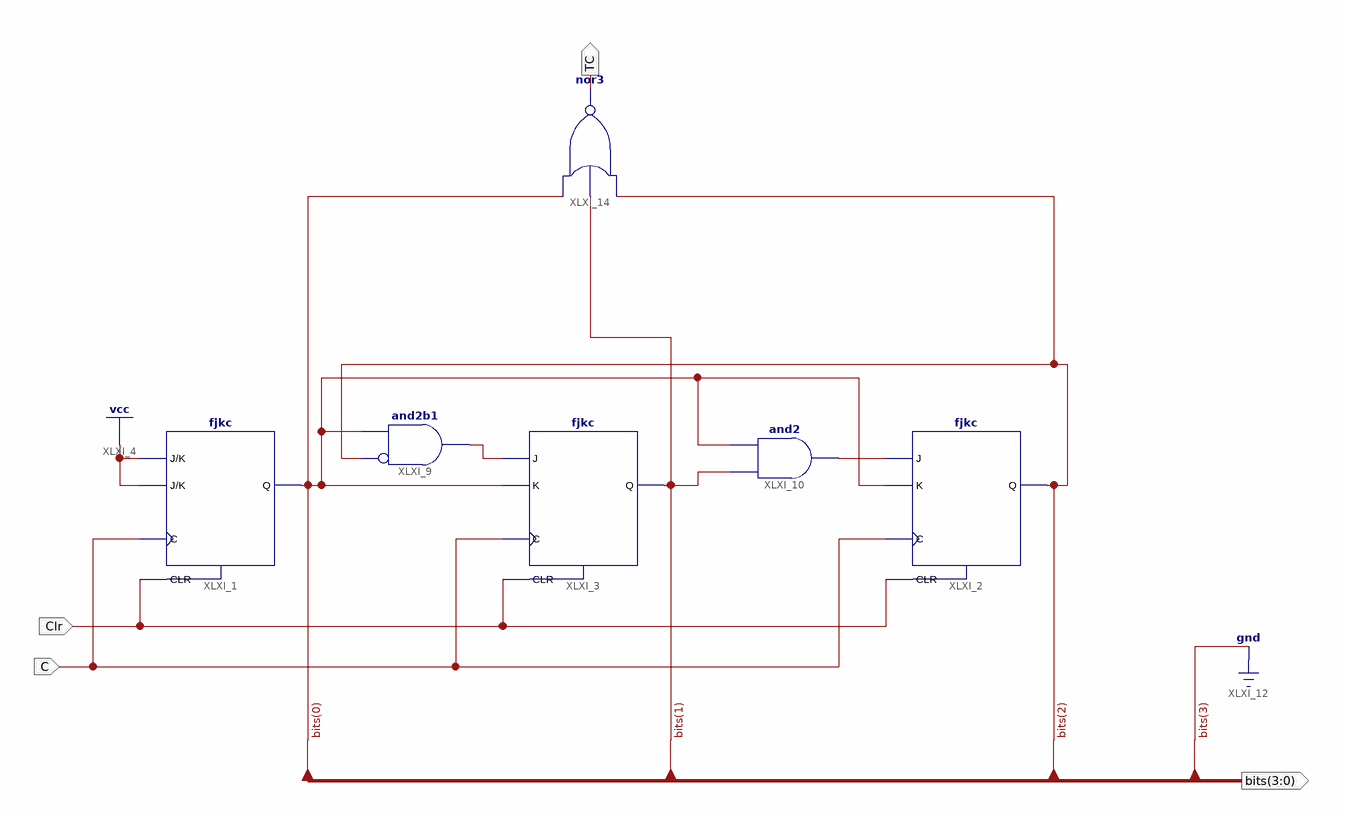
[diagram p0: schematic sheet 1]
// Xilinx ISE schematic counter0_5nn.sch (spartan6) as structural Verilog: 6 symbols, 4 ports
module counter0_5nn (
  input  Clr,
  input  C,
  output [3:0] bits,
  output TC
);

  wire XLXN_6, XLXN_7;

  fjkc XLXI_1 (.C(C), .CLR(Clr), .J(1'b1), .K(1'b1), .Q(bits[0]));
  fjkc XLXI_2 (.C(C), .CLR(Clr), .J(XLXN_7), .K(bits[0]), .Q(bits[2]));
  fjkc XLXI_3 (.C(C), .CLR(Clr), .J(XLXN_6), .K(bits[0]), .Q(bits[1]));
  and XLXI_9 (XLXN_6, ~bits[2], bits[0]);  // and2b1
  and XLXI_10 (XLXN_7, bits[1], bits[0]);
  nor XLXI_14 (TC, bits[2], bits[1], bits[0]);

  assign bits[3] = 1'b0;
endmodule
